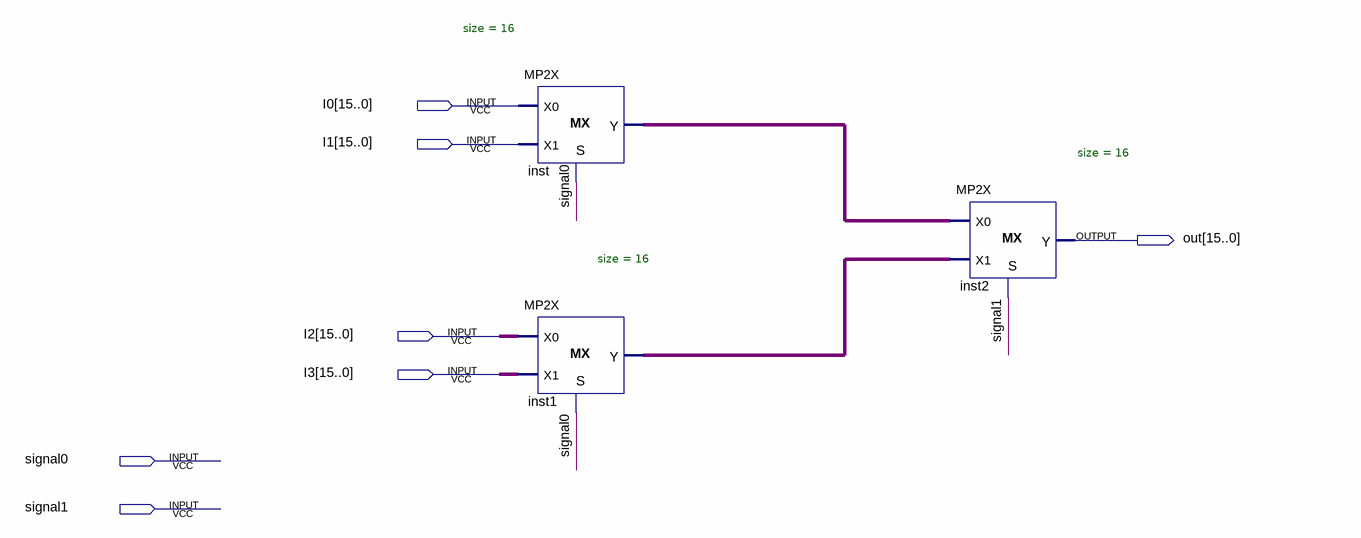
[diagram p0: schematic sheet]
// Quartus schematic MP16_4.bdf as structural Verilog: 3 symbols, 7 pins
module MP16_4 (
  input  [15:0] I0,
  input  [15:0] I1,
  input  [15:0] I2,
  input  [15:0] I3,
  input  signal0,
  input  signal1,
  output [15:0] out
);

  wire [15:0] inst1_y, inst_y;

  MP2X #(.size(16)) inst (.S(signal0), .X0(I0), .X1(I1), .Y(inst_y));
  MP2X #(.size(16)) inst1 (.S(signal0), .X0(I2), .X1(I3), .Y(inst1_y));
  MP2X #(.size(16)) inst2 (.S(signal1), .X0(inst_y), .X1(inst1_y), .Y(out));
endmodule
